# Altium schematic sheet STM32.SchDoc
size A; SheetNumber: 1; SheetTotal: 13
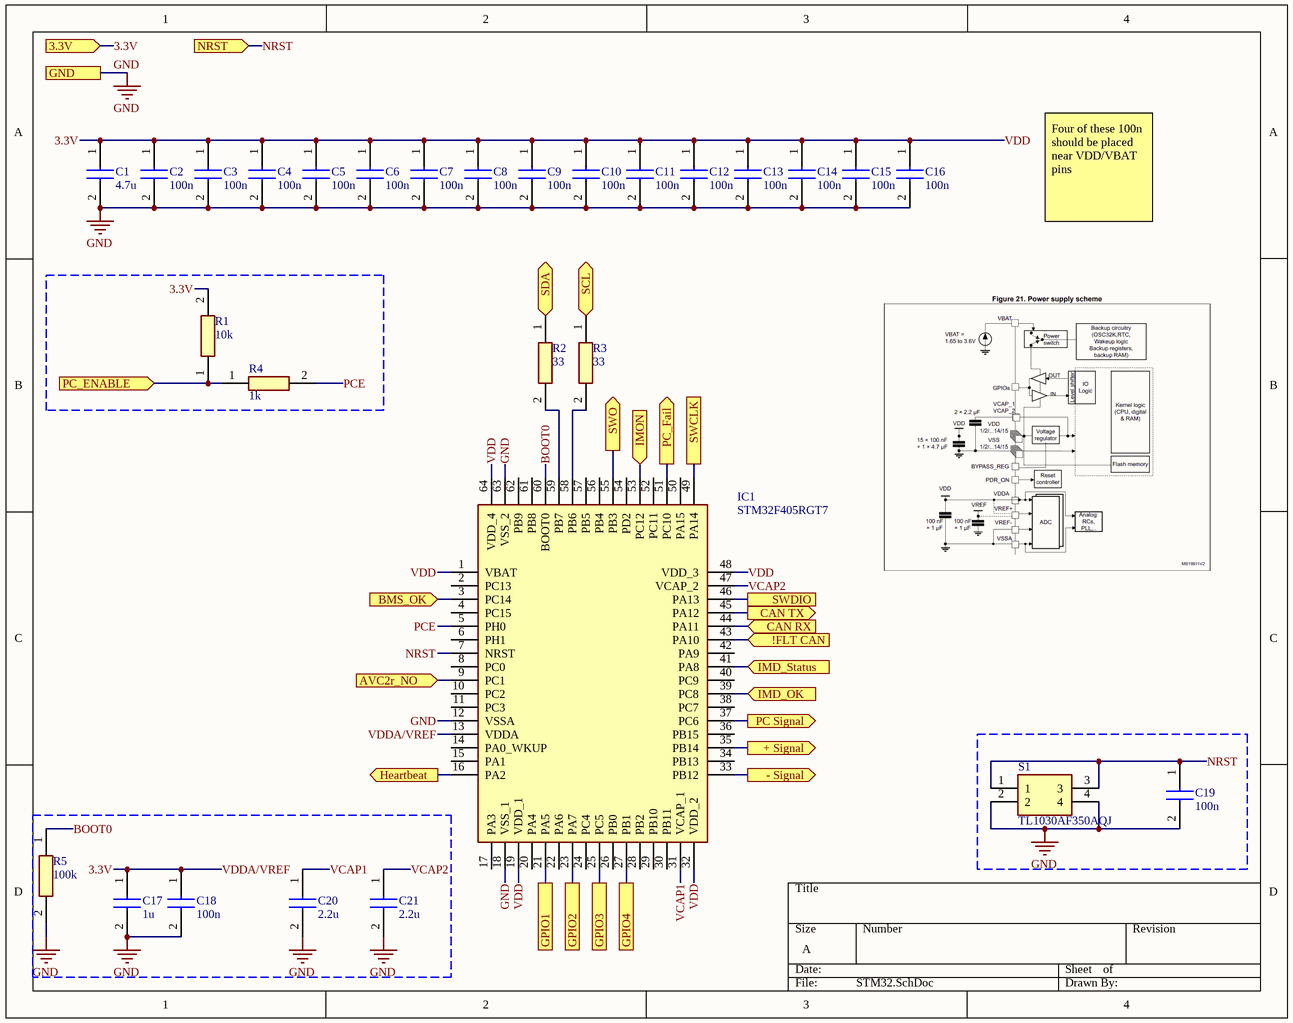
[diagram p0: STM32.SchDoc]

## Parts
C1  4.7u  [CAPC2012X145N]
C2  100n  [CAPC1608X90N]
C3  100n  [CAPC1608X90N]
C4  100n  [CAPC1608X90N]
C5  100n  [CAPC1608X90N]
C6  100n  [CAPC1608X90N]
C7  100n  [CAPC1608X90N]
C8  100n  [CAPC1608X90N]
C9  100n  [CAPC1608X90N]
C10  100n  [CAPC1608X90N]
C11  100n  [CAPC1608X90N]
C12  100n  [CAPC1608X90N]
C13  100n  [CAPC1608X90N]
C14  100n  [CAPC1608X90N]
C15  100n  [CAPC1608X90N]
C16  100n  [CAPC1608X90N]
C17  1u  [CAPC1608X95N]
C18  100n  [CAPC1608X90N]
C19  100n  [CAPC1608X90N]
C20  2.2u  [MBASx168]
C21  2.2u  [MBASx168]
IC1  STM32F405RGT7  [QFP50P1200X1200X160-64N]
R1  10k  [RESC1608X55N]
R2  33  [RESC1608X50N]
R3  33  [RESC1608X50N]
R4  1k  [RESC1608X55N]
R5  100k  [RESC1608X55N]
S1  TL1030AF350AQJ  [TL1030AF350AQJ]

## Ports
3.3V (in), !FLT CAN (in), + Signal (out), - Signal (out), AVC2r_NO (in), BMS_OK (in), CAN RX (in), CAN TX (out), GND, GPIO1, GPIO2, GPIO3, GPIO4, Heartbeat (out), IMD_OK (in), IMD_Status (in), IMON (in), NRST (in), PC Signal (out), PC_ENABLE (in), PC_Fail (out), SCL (bidir), SDA (bidir), SWCLK, SWDIO, SWO (out)

## Nets
GND: C1.2 C2.2 C3.2 C4.2 C5.2 C6.2 C7.2 C8.2 C9.2 C10.2 C11.2 C12.2 C13.2 C14.2 C15.2 C16.2 C17.2 C18.2 C19.2 C20.2 C21.2 IC1.12(VSSA) IC1.18(VSS_1) IC1.63(VSS_2) R5.2 S1.2 S1.4 ; port GND
3.3V: C1.1 C2.1 C3.1 C4.1 C5.1 C6.1 C7.1 C8.1 C9.1 C10.1 C11.1 C12.1 C13.1 C14.1 C15.1 C16.1 C17.1 C18.1 IC1.1(VBAT) IC1.13(VDDA) IC1.19(VDD_1) IC1.32(VDD_2) IC1.48(VDD_3) IC1.64(VDD_4) R1.2 ; port 3.3V  [also labelled VDD, VDDA/VREF]
!FLT CAN: IC1.43(PA10) ; port !FLT CAN
+ Signal: IC1.35(PB14) ; port + Signal
- Signal: IC1.33(PB12) ; port - Signal
AVC2r_NO: IC1.9(PC1) ; port AVC2r_NO
BMS_OK: IC1.3(PC14) ; port BMS_OK
BOOT0: IC1.60(BOOT0) R5.1
CAN RX: IC1.44(PA11) ; port CAN RX
CAN TX: IC1.45(PA12) ; port CAN TX
GPIO1: IC1.21(PA5) ; port GPIO1
GPIO2: IC1.23(PA7) ; port GPIO2
GPIO3: IC1.25(PC5) ; port GPIO3
GPIO4: IC1.27(PB1) ; port GPIO4
Heartbeat: IC1.16(PA2) ; port Heartbeat
IMD_OK: IC1.39(PC8) ; port IMD_OK
IMD_Status: IC1.41(PA8) ; port IMD_Status
IMON: IC1.53(PC12) ; port IMON
NRST: C19.1 IC1.7(NRST) S1.1 S1.3 ; port NRST
PC Signal: IC1.37(PC6) ; port PC Signal
PC_ENABLE: R1.1 R4.1 ; port PC_ENABLE
PC_Fail: IC1.51(PC10) ; port PC_Fail
PCE: IC1.5(PH0) R4.2
SCL: R3.1 ; port SCL
SDA: R2.1 ; port SDA
SWCLK: IC1.49(PA14) ; port SWCLK
SWDIO: IC1.46(PA13) ; port SWDIO
SWO: IC1.55(PB3) ; port SWO
VCAP1: C20.1 IC1.31(VCAP_1)
VCAP2: C21.1 IC1.47(VCAP_2)
NetIC1_58: IC1.58(PB6) R3.2
NetIC1_59: IC1.59(PB7) R2.2

Not connected (* = marked no-connect by the designer): IC1 2(PC13) 4(PC15) 6(PH1) 8(PC0) 10(PC2) 11(PC3) 14(PA0_WKUP) 15(PA1) 17(PA3) 20(PA4) 22(PA6) 24(PC4) 26(PB0) 28(PB2) 29(PB10) 30(PB11) 34(PB13) 36(PB15) 38(PC7) 40(PC9) 42(PA9) 50(PA15) 52(PC11) 54(PD2) 56(PB4) 57(PB5) 61(PB8) 62(PB9)

## Notes on the sheet
- Four of these 100n should be placed near VDD/VBAT pins

## Library data of the parts
C1 = GRM21BR61H475ME51L: Capacitor; Manufacturer_Name: Murata Electronics; Datasheet Link: https://search.murata.co.jp/Ceramy/image/img/A01X/G101/ENG/GRM21BR61H475ME51-01A.pdf; Height: 1.45mm; Manufacturer_Part_Number: GRM21BR61H475ME51L; Mouser Part Number: 81-GRM21BR61H475M51L; Mouser Price/Stock: https://www.mouser.co.uk/ProductDetail/Murata-Electronics/GRM21BR61H475ME51L?qs=eeBpzGFlv%252B%2Fg0wAeHy0eJw%3D%3D; Arrow Part Number: GRM21BR61H475ME51L; Arrow Price/Stock: https://www.arrow.com/en/products/grm21br61h475me51l/murata-manufacturing?region=nac
C2-C16 C18 C19 = 06035C104J4Z2A: Capacitor; Manufacturer_Name: Kyocera AVX; Datasheet Link: https://componentsearchengine.com/Datasheets/1/06031A100FAT2A.pdf; Height: 0.9mm; Manufacturer_Part_Number: 06035C104J4Z2A; Mouser Part Number: 581-06035C104J4Z2A; Mouser Price/Stock: https://www.mouser.co.uk/ProductDetail/KYOCERA-AVX/06035C104J4Z2A?qs=Awwwc1gvTnlncvTGCFZvkw%3D%3D; Arrow Part Number: 06035C104J4Z2A; Arrow Price/Stock: https://www.arrow.com/en/products/06035c104j4z2a/avx
C17 = UMK107AB7105KA-T: Capacitor; Manufacturer_Name: TAIYO YUDEN; Datasheet Link: https://ds.yuden.co.jp/TYCOMPAS/or/detail?pn=UMK107AB7105KA-T&u=M; Height: 0.95mm; Manufacturer_Part_Number: UMK107AB7105KA-T; Mouser Part Number: 963-UMK107AB7105KA-T; Mouser Price/Stock: https://www.mouser.co.uk/ProductDetail/TAIYO-YUDEN/UMK107AB7105KA-T?qs=%252BAZVS4b%2FkgKLk%2FvFAZMoRQ%3D%3D; Arrow Part Number: UMK107AB7105KA-T; Arrow Price/Stock: https://www.arrow.com/en/products/umk107ab7105ka-t/taiyo-yuden?utm_currency=USD&region=nac
C20 C21 = MBASL168SB5225KTNA01: Capacitor; Manufacturer_Name: TAIYO YUDEN; Datasheet Link: https://ds.yuden.co.jp/TYCOMPAS/or/detail?pn=MBASL168SB5225KTNA01; Height: 0.8mm; Manufacturer_Part_Number: MBASL168SB5225KTNA01
IC1 = STM32F405RGT7: Integrated Circuit; Manufacturer_Name: STMicroelectronics; Datasheet Link: https://www.st.com/content/ccc/resource/technical/document/datasheet/ef/92/76/6d/bb/c2/4f/f7/DM00037051.pdf/files/DM00037051.pdf/jcr:content/translations/en.DM00037051.pdf; Height: 1.6mm; Manufacturer_Part_Number: STM32F405RGT7; Mouser Part Number: 511-STM32F405RGT7; Mouser Price/Stock: https://www.mouser.co.uk/ProductDetail/STMicroelectronics/STM32F405RGT7?qs=DqCdCwOw4%2F6rAq3yUvY8rA%3D%3D; Arrow Part Number: STM32F405RGT7; Arrow Price/Stock: https://www.arrow.com/en/products/stm32f405rgt7/stmicroelectronics?utm_currency=USD&region=nac
R1 = CRGCQ0603F10K: Resistor; Manufacturer_Name: TE Connectivity; Datasheet Link: https://www.te.com/commerce/DocumentDelivery/DDEController?Action=showdoc&DocId=Data+Sheet%7F1773204-3%7F1%7Fpdf%7FEnglish%7FENG_DS_1773204-3_1.pdf%7F5-2176339-2; Height: 0.55mm; Manufacturer_Part_Number: CRGCQ0603F10K; Mouser Part Number: 279-CRGCQ0603F10K; Mouser Price/Stock: https://www.mouser.co.uk/ProductDetail/TE-Connectivity-Holsworthy/CRGCQ0603F10K?qs=wUXugUrL1qxhM765MzQWJg%3D%3D; Arrow Part Number: CRGCQ0603F10K; Arrow Price/Stock: https://www.arrow.com/en/products/crgcq0603f10k/te-connectivity?region=nac
R2 R3 = CRCW060333R0JNEC: Resistor; Manufacturer_Name: Vishay; Datasheet Link: http://www.vishay.com/docs/20035/dcrcwe3.pdf; Height: 0.5mm; Manufacturer_Part_Number: CRCW060333R0JNEC; Mouser Part Number: 71-CRCW060333R0JNEC; Mouser Price/Stock: https://www.mouser.co.uk/ProductDetail/Vishay-Dale/CRCW060333R0JNEC?qs=ZO1m%252BzWAUg2kwAG1IfiiMA%3D%3D; Arrow Part Number: CRCW060333R0JNEC; Arrow Price/Stock: https://www.arrow.com/en/products/crcw060333r0jnec/vishay?region=nac
R4 = RMCF0603JT1K00: Resistor; Manufacturer_Name: Stackpole Electronics; Datasheet Link: https://www.seielect.com/Catalog/SEI-RMCF_RMCP.pdf; Height: 0.55mm; Manufacturer_Part_Number: RMCF0603JT1K00; Mouser Part Number: 708-RMCF0603JT1K00; Mouser Price/Stock: https://www.mouser.co.uk/ProductDetail/SEI-Stackpole/RMCF0603JT1K00?qs=FESYatJ8odK3lrUeqnFxyg%3D%3D; Arrow Part Number: RMCF0603JT1K00; Arrow Price/Stock: https://www.arrow.com/en/products/rmcf0603jt1k00/stackpole-electronics?region=nac
R5 = CR0603-JW-104ELF: Resistor; Manufacturer_Name: Bourns; Datasheet Link: https://www.bourns.com/pdfs/chpreztr.pdf; Height: 0.55mm; Manufacturer_Part_Number: CR0603-JW-104ELF; Mouser Part Number: 652-CR0603-JW-104ELF; Mouser Price/Stock: https://www.mouser.co.uk/ProductDetail/Bourns/CR0603-JW-104ELF?qs=wOX%252BDVkMoZSK2gq9cFrtRg%3D%3D; Arrow Part Number: CR0603-JW-104ELF; Arrow Price/Stock: https://www.arrow.com/en/products/cr0603-jw-104elf/bourns?region=nac
S1 = TL1030AF350AQJ: Switch; Manufacturer_Name: E-Switch; Datasheet Link: https://configured-product-images.s3.amazonaws.com/2D/specs/TL1030AF350AQJ.pdf; Height: 1.95mm; Manufacturer_Part_Number: TL1030AF350AQJ; Mouser Part Number: 612-TL1030AF350AQJ; Mouser Price/Stock: https://www.mouser.co.uk/ProductDetail/E-Switch/TL1030AF350AQJ?qs=VVKQmw408U%2FgalG8VZqjEg%3D%3D